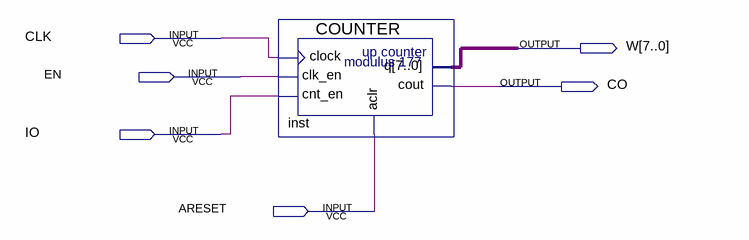
[diagram p0: schematic sheet]
// Quartus schematic E2_QQ.bdf as structural Verilog: 1 symbols, 6 pins
module E2_QQ (
  input  CLK,
  input  EN,
  input  IO,
  input  ARESET,
  output [7:0] W,
  output CO
);

  COUNTER inst (.clock(CLK), .clk_en(EN), .cnt_en(IO), .aclr(ARESET), .cout(CO), .q(W));
endmodule
